# EAGLE schematic untitled (EAGLE 9.6.2)
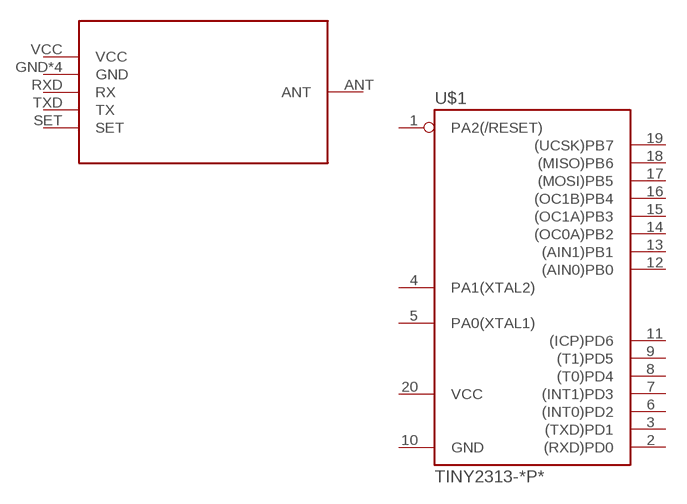
[diagram p0: schematic, sheet 1]

## Parts
U$1  TINY2313-*P*  [DIL20]
U$2  HC-12_FOOTPRINT  [HC-12_FOOTPRINT]
Unconnected: U$1.1(PA2(/RESET)) U$1.2((RXD)PD0) U$1.3((TXD)PD1) U$1.4(PA1(XTAL2)) U$1.5(PA0(XTAL1)) U$1.6((INT0)PD2) U$1.7((INT1)PD3) U$1.8((T0)PD4) U$1.9((T1)PD5) U$1.11((ICP)PD6) U$1.12((AIN0)PB0) U$1.13((AIN1)PB1) U$1.14((OC0A)PB2) U$1.15((OC1A)PB3) U$1.16((OC1B)PB4) U$1.17((MOSI)PB5) U$1.18((MISO)PB6) U$1.19((UCSK)PB7) U$2.ANT U$2.GND U$2.GND1(GND) U$2.GND2(GND) U$2.MCHFIX(GND) U$2.RXD(RX) U$2.SET U$2.TXD(TX) U$2.VCC

## Power pins joined to a net without a drawn wire
GND: U$1.10(GND)
VCC: U$1.20(VCC)

## Library data of the parts
U$1 = avr-7:TINY2313*: Atmel Tiny2313 2K Flash, 128 bytes EEPROM, 128 bytes RAM
U$2 = hc12:HC-12_FOOTPRINT: HC-12 433MHz module footprint MCHFIX is for mechanical fix pin which is NC but on this file connected to GND https://github.com/meendiz/hc-12_si4463/